# EasyEDA schematic SCH_Mini-Converter_2024-05-02.json
TITLE: Sheet_1; REV: 1.0; Date: 2023-10-23; Sheet: 1/1; Drawn By: GreatScott; Company: Your Company
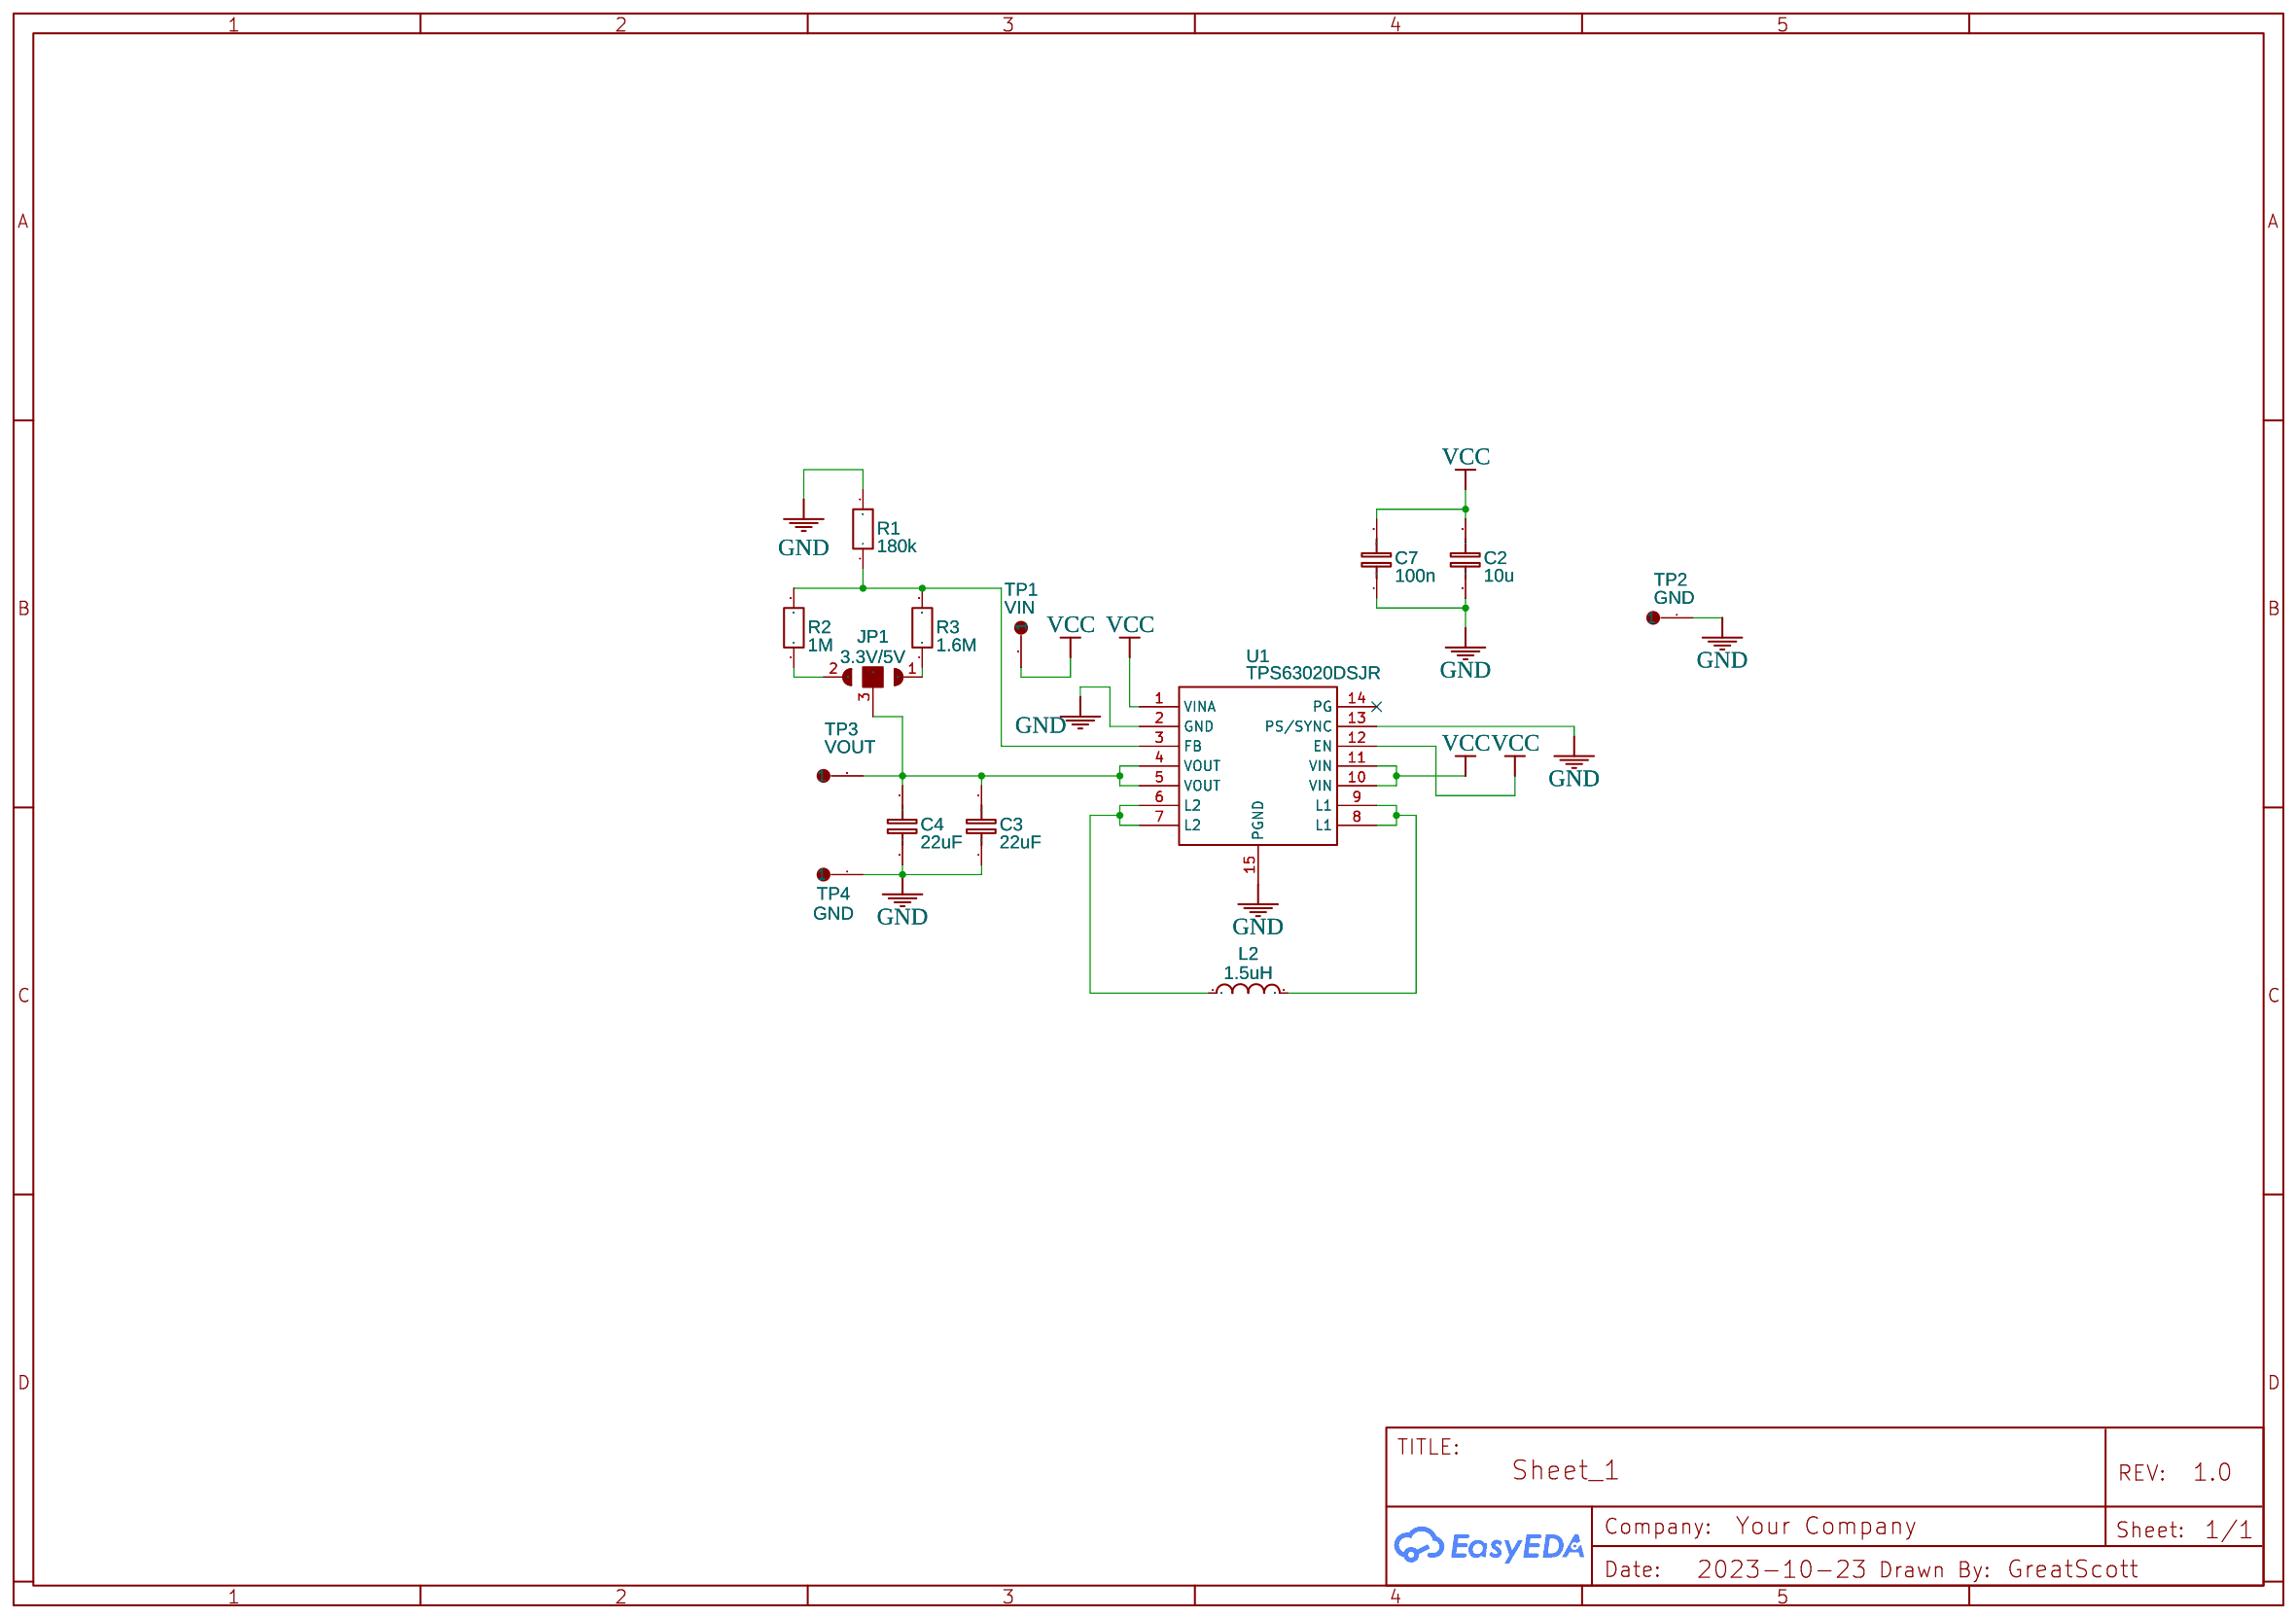
[diagram p0: schematic sheet]

## Parts
C2  10u  [C0805]
C3  22uF  [C0805]
C4  22uF  [C0805]
C7  100n  [C0805]
JP1  3.3V/5V  [SOLDER BRIDGE 3P UNBRIDGED]
L2  1.5uH  [IND-SMD_L3.0-W3.0-SPM3020-2R2M]
R1  180k  [R0805]
R2  1M  [R0805]
R3  1.6M  [R0805]
TP1  VIN  [PKG-TEST-POINT-PTH-1X1]
TP2  GND  [PKG-TEST-POINT-PTH-1X1]
TP3  VOUT  [PKG-TEST-POINT-PTH-1X1]
TP4  GND  [PKG-TEST-POINT-PTH-1X1]
U1  TPS63020DSJR  [VSON-14_L4.0-W3.0-P0.50-BL-EP_TI_DSJ]

## Library data of the parts
C2-C4 C7 = C_0805_EU: Contributor: LCEDA_Lib
JP1 = SOLDER BRIDGE: Contributor: leif
L2 = 78438336100: Contributor: LCSC; Supplier: LCSC; Supplier Part: C2915156; JLCPCB Part Class: Extended Part; link: https://lcsc.com/eda_search?q=C2915156&%26type=1&ref=editor
R1-R3 = R_0805_EU: Contributor: LCEDA_Lib
TP1-TP4 = TEST-POINT-PTH-1X1
U1 = TPS63020DSJR: Supplier: LCSC; Manufacturer: TI(德州仪器); Supplier Part: C15483; JLCPCB Part Class: Extended Part; link: https://lcsc.com/eda_search?q=C15483&%26type=1&ref=editor

## Nets
GND: C2.1 C3.1 C4.1 C7.1 R1.2 TP2.1 TP4.1 U1.2(GND) U1.13(PS/SYNC) U1.15(PGND)
VCC: C2.2 C7.2 TP1.1 U1.1(VINA) U1.10(VIN) U1.11(VIN) U1.12(EN)
Net-(C3-2): C3.2 C4.2 JP1.3 TP3.1 U1.4(VOUT) U1.5(VOUT)
Net-(JP1-1): JP1.1 R3.1
Net-(JP1-2): JP1.2 R2.1
Net-(L2-1): L2.1 U1.6(L2) U1.7(L2)
Net-(L2-2): L2.2 U1.8(L1) U1.9(L1)
Net-(R1-1): R1.1 R2.2 R3.2 U1.3(FB)

Not connected (* = marked no-connect by the designer): U1 14(PG)*
